# Altium schematic sheet Vexillarius V1 Body.SchDoc
size A3
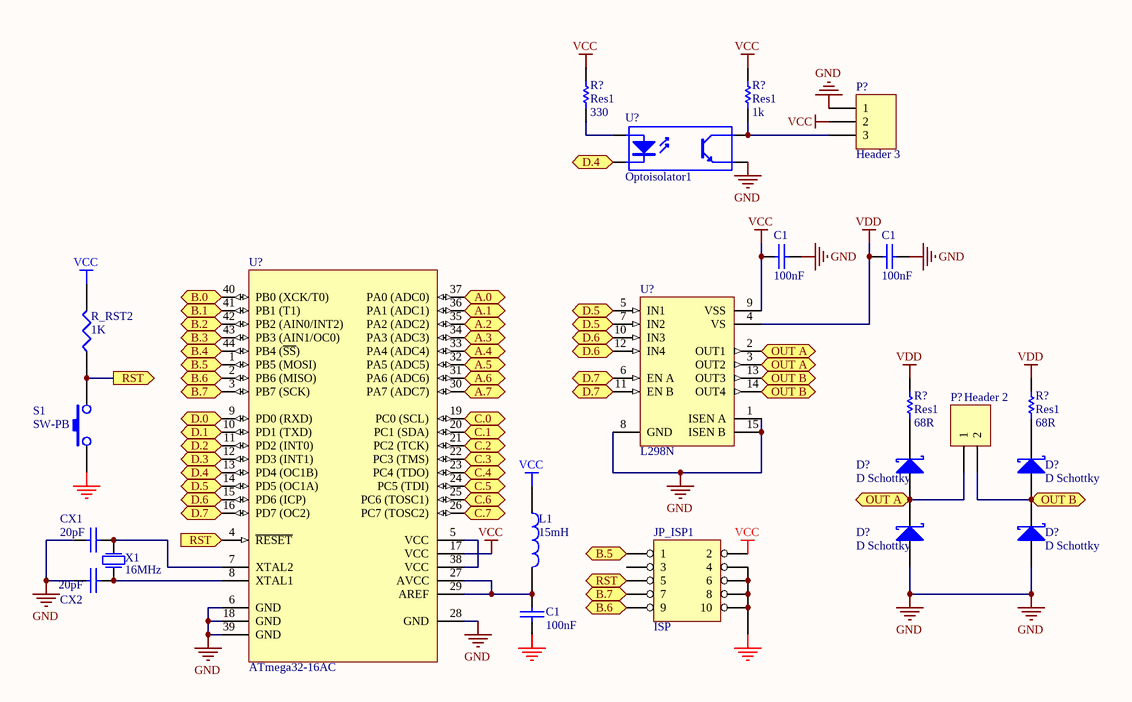
[diagram p0: Vexillarius V1 Body.SchDoc]

## Parts
(Parts that share a designator on the sheet are numbered #1, #2 ... from top to bottom, then left to right.)
C1#1  100nF  [rad0.2]
C1#2  100nF  [rad0.2]
C1#3  100nF  [rad0.2]
CX1  20pF  [rad0.1]
CX2  20pF  [rad0.1]
D?#1  D Schottky  [DSO-C2/X2.3]
D?#2  D Schottky  [DSO-C2/X2.3]
D?#3  D Schottky  [DSO-C2/X2.3]
D?#4  D Schottky  [DSO-C2/X2.3]
JP_ISP1  ISP  [hdr2x5]
L1  15mH  [axial0.3]
P?#1  Header 3  [HDR1X3]
P?#2  Header 2  [HDR1X2]
R?#1  Res1  value 330  [AXIAL-0.3]
R?#2  Res1  value 1k  [AXIAL-0.3]
R?#3  Res1  value 68R  [AXIAL-0.3]
R?#4  Res1  value 68R  [AXIAL-0.3]
R_RST2  1K  [axial0.3]
S1  SW-PB  [RAD0.2]
U?#1  Optoisolator1  [DIP-4]
U?#2  ATmega32-16AC  [44A_N]
U?#3  L298N  [Multiwatt15V]
X1  16MHz  [rad0.2]

## Ports
A.0, A.1, A.2, A.3, A.4, A.5, A.6, A.7, B.0, B.1, B.2, B.3, B.4, B.5, B.6, B.7, C.0, C.1, C.2, C.3, C.4, C.5, C.6, C.7, D.0, D.1, D.2, D.3, D.4, D.5, D.6, D.7, OUT A, OUT B, RST, RST (out)

## Nets
GND: C1#1.2 C1#2.2 C1#3.2 CX1.1 CX2.1 D?#3.1(A) D?#4.1(A) JP_ISP1.4 JP_ISP1.6 JP_ISP1.8 JP_ISP1.10 P?#1.1 S1.1 U?#1.3(E) U?#2.6(GND) U?#2.18(GND) U?#2.28(GND) U?#2.39(GND) U?#3.1(ISEN_A) U?#3.8(GND) U?#3.15(ISEN_B)
VCC: C1#1.1 JP_ISP1.2 L1.1 P?#1.2 R?#1.2 R?#2.2 R_RST2.2 U?#2.17(VCC) U?#3.9(VSS)
VDD: C1#2.1 R?#3.2 R?#4.2 U?#3.4(VS)
A.0: U?#2.37(PA0_(ADC0)) ; port A.0
A.1: U?#2.36(PA1_(ADC1)) ; port A.1
A.2: U?#2.35(PA2_(ADC2)) ; port A.2
A.3: U?#2.34(PA3_(ADC3)) ; port A.3
A.4: U?#2.33(PA4_(ADC4)) ; port A.4
A.5: U?#2.32(PA5_(ADC5)) ; port A.5
A.6: U?#2.31(PA6_(ADC6)) ; port A.6
A.7: U?#2.30(PA7_(ADC7)) ; port A.7
B.0: U?#2.40(PB0_(XCK/T0)) ; port B.0
B.1: U?#2.41(PB1_(T1)) ; port B.1
B.2: U?#2.42(PB2_(AIN0/INT2)) ; port B.2
B.3: U?#2.43(PB3_(AIN1/OC0)) ; port B.3
B.4: U?#2.44(PB4_(~{SS})) ; port B.4
B.5: JP_ISP1.1 U?#2.1(PB5_(MOSI)) ; port B.5
B.6: JP_ISP1.9 U?#2.2(PB6_(MISO)) ; port B.6
B.7: JP_ISP1.7 U?#2.3(PB7_(SCK)) ; port B.7
C.0: U?#2.19(PC0_(SCL)) ; port C.0
C.1: U?#2.20(PC1_(SDA)) ; port C.1
C.2: U?#2.21(PC2_(TCK)) ; port C.2
C.3: U?#2.22(PC3_(TMS)) ; port C.3
C.4: U?#2.23(PC4_(TDO)) ; port C.4
C.5: U?#2.24(PC5_(TDI)) ; port C.5
C.6: U?#2.25(PC6_(TOSC1)) ; port C.6
C.7: U?#2.26(PC7_(TOSC2)) ; port C.7
D.0: U?#2.9(PD0_(RXD)) ; port D.0
D.1: U?#2.10(PD1_(TXD)) ; port D.1
D.2: U?#2.11(PD2_(INT0)) ; port D.2
D.3: U?#2.12(PD3_(INT1)) ; port D.3
D.4: U?#1.2(K) U?#2.13(PD4_(OC1B)) ; port D.4
D.5: U?#2.14(PD5_(OC1A)) U?#3.5(IN1) U?#3.7(IN2) ; port D.5
D.6: U?#2.15(PD6_(ICP)) U?#3.10(IN3) U?#3.12(IN4) ; port D.6
D.7: U?#2.16(PD7_(OC2)) U?#3.6(EN_A) U?#3.11(EN_B) ; port D.7
OUT A: D?#1.1(A) D?#3.2(K) P?#2.1 U?#3.2(OUT1) U?#3.3(OUT2) ; port OUT A
OUT B: D?#2.1(A) D?#4.2(K) P?#2.2 U?#3.13(OUT3) U?#3.14(OUT4) ; port OUT B
RST: JP_ISP1.5 R_RST2.1 S1.2 U?#2.4(~{RESET}) ; port RST
NetC1#3_1: C1#3.1 L1.2 U?#2.27(AVCC) U?#2.29(AREF)
NetCX1_2: CX1.2 U?#2.7(XTAL2) X1.1(P1)
NetCX2_2: CX2.2 U?#2.8(XTAL1) X1.2(P2)
NetD?#1_2: D?#1.2(K) R?#3.1
NetD?#2_2: D?#2.2(K) R?#4.1
NetP?#1_3: P?#1.3 R?#2.1 U?#1.4(C)
NetR?#1_1: R?#1.1 U?#1.1(A)
NetU?#2_5: U?#2.5(VCC) U?#2.38(VCC)

Not connected (* = marked no-connect by the designer): JP_ISP1 3

## Library data of the parts
C1#1-C1#3 CX1 CX2 = CAP: Capacitor
D?#1-D?#4 = D Schottky: Schottky Diode; Published: 8-Jun-2000; LatestRevisionDate: 17-Jul-2002; LatestRevisionNote: Re-released for DXP Platform.; PackageReference: SMB; Publisher: Altium Limited; Code_JEDEC: DO-214-AA
JP_ISP1 = HEADER 5X2
L1 = INDUCTOR
P?#1 = Header 3: Header, 3-Pin; LatestRevisionDate: 17-Jul-2002; LatestRevisionNote: Re-released for DXP Platform.; Publisher: Altium Limited
P?#2 = Header 2: Header, 2-Pin; LatestRevisionDate: 17-Jul-2002; LatestRevisionNote: Re-released for DXP Platform.; Publisher: Altium Limited
R?#1-R?#4 = Res1: Resistor; Published: 8-Jun-2000; LatestRevisionDate: 17-Jul-2002; LatestRevisionNote: Re-released for DXP Platform.; PackageReference: AXIAL-0.3; Publisher: Altium Limited
R_RST2 = RES1
U?#1 = Optoisolator1: 4-Pin Phototransistor Optocoupler; Published: 24-Mar-1999; LatestRevisionDate: 04-Mar-2005; LatestRevisionNote: Sch pins 3 & 4 Swapped.; DatasheetVersion: Nov-2003; PackageReference: DIP-4; Publisher: Altium Limited
U?#2 = ATmega32-16AC: 8-Bit AVR Microcontroller with 32K Bytes of In-System Programmable Flash Memory; Published: 17-Sep-2003; LatestRevisionDate: 13-Apr-2006; LatestRevisionNote: IPC-7351 Footprint Added.; DatasheetVersion: 2503C-AVR-10/02; PackageVersion: rev.B, Oct-2001; PackageReference: 44A; Publisher: Altium Limited; PackageDescription: 44-Pin Thin Quad Flat Pack 0.8 mm Pitch; ComponentLink1Description: Manufacturer Link; ComponentLink1URL: http://www.atmel.com; ComponentLink2Description: Datasheet; ComponentLink2URL: http://www.atmel.com/dyn/resources/prod_documents/doc2503.pdf
U?#3 = L298N: Dual Full Bridge Driver; Published: 8-Jun-2000; LatestRevisionDate: 14-May-2007; LatestRevisionNote: Mapped to vertical PCB.; DatasheetVersion: Jul-1999; PackageReference: Multiwatt15V; Publisher: Altium Limited; PackageDescription: TO, Thru-Hole, Vertical, Heatsink Mounted; 15 Bent Staggered Leads; Pitch 1.27 mm; ComponentLink1Description: Manufacturer Link; ComponentLink1URL: http://www.st.com/; ComponentLink2Description: Datasheet; ComponentLink2URL: http://www.st.com/stonline/products/literature/ds/1773/l298.pdf
X1 = 11.0952MHZ: Crystal Oscillator